# EAGLE schematic MegaWithL298 (EAGLE 7.3.0)
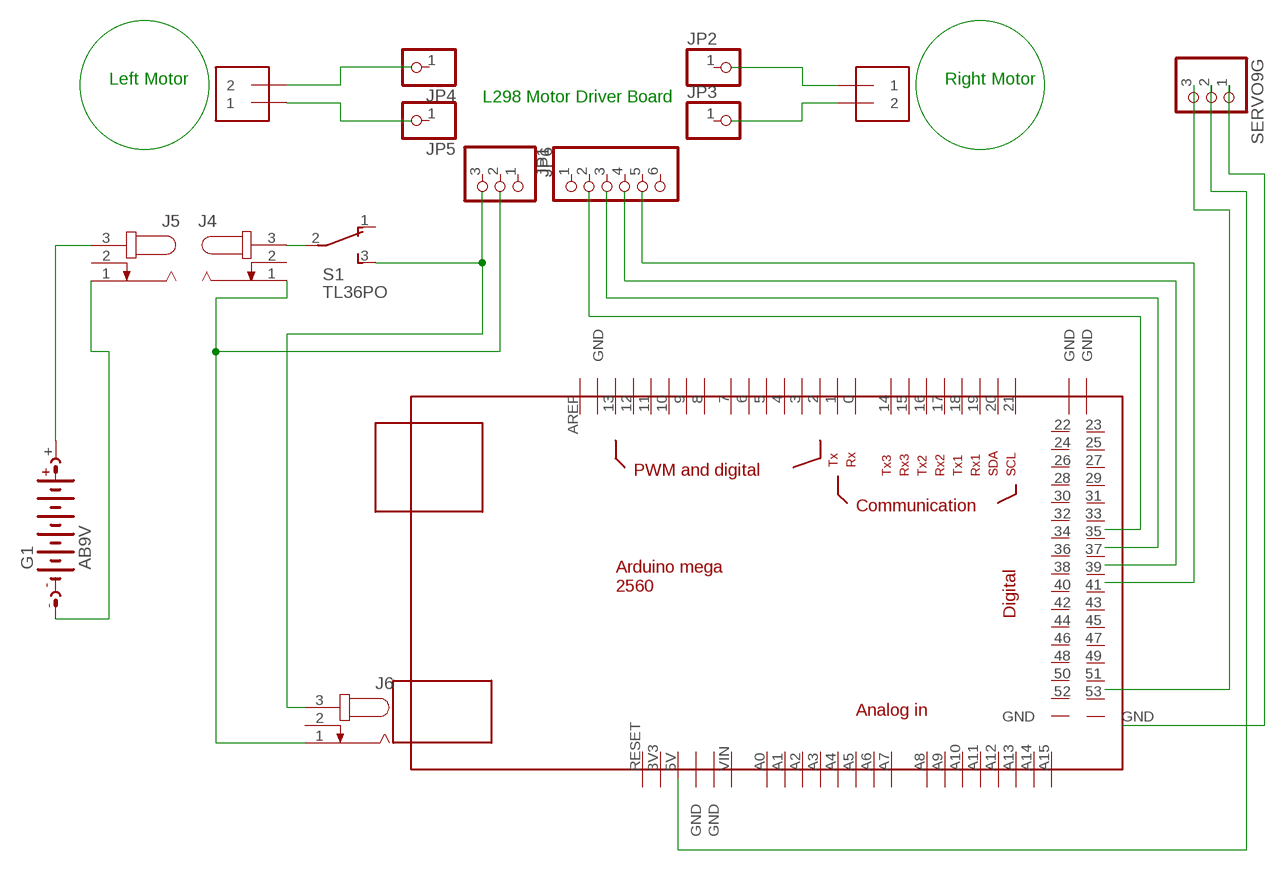
[diagram p0: schematic, sheet 1]

## Parts
G1  AB9V  [AB9V]
J2  1X2-3.5MM  [1X2-3.5MM]
J3  1X2-3.5MM  [1X2-3.5MM]
J4  RAPC7120  [RAPC712]
J5  RAPC7120  [RAPC712]
J6  RAPC7120  [RAPC712]
JP1  PINHD-1X6  [1X06]
JP2  PINHD-1X1  [1X01]
JP3  PINHD-1X1  [1X01]
JP4  PINHD-1X1  [1X01]
JP5  PINHD-1X1  [1X01]
JP6  PINHD-1X3  [1X03]
S1  TL36PO  [TL3XPO]
SERVO9G  PINHD-1X3  [1X03]
U$1  MEGA_DEVICE  [MEGABOX]

## Nets
N$1: J2.2
N$2: J2.1
N$3: J3.2
N$4: J3.1
N$10: SERVO9G.1
N$11: SERVO9G.2
N$12: J4.3 S1.2(P)
N$13: J6.3 S1.3(S)
N$14: G1.+ J5.3
N$15: G1.- J5.1
N$16: J4.1 J6.1
N$17: SERVO9G.3
Unconnected: J4.2 J5.2 J6.2 JP1.1 JP1.2 JP1.3 JP1.4 JP1.5 JP1.6 JP2.1 JP3.1 JP4.1 JP5.1 JP6.1 JP6.2 JP6.3 S1.1(O) U$1.0 U$1.1 U$1.2 U$1.3 U$1.3V3 U$1.4 U$1.5 U$1.5V U$1.6 U$1.7 U$1.8 U$1.9 U$1.10 U$1.11 U$1.12 U$1.13 U$1.14 U$1.15 U$1.16 U$1.17 U$1.18 U$1.19 U$1.20 U$1.21 U$1.22 U$1.23 U$1.24 U$1.25 U$1.26 U$1.27 U$1.28 U$1.29 U$1.30 U$1.31 U$1.32 U$1.33 U$1.34 U$1.35 U$1.36 U$1.37 U$1.38 U$1.39 U$1.40 U$1.41 U$1.42 U$1.43 U$1.44 U$1.45 U$1.46 U$1.47 U$1.48 U$1.49 U$1.50 U$1.51 U$1.52 U$1.53 U$1.A0 U$1.A1 U$1.A2 U$1.A3 U$1.A4 U$1.A5 U$1.A6 U$1.A7 U$1.A8 U$1.A9 U$1.A10 U$1.A11 U$1.A12 U$1.A13 U$1.A14 U$1.A15 U$1.AREF U$1.GND@1(GND) U$1.GND@2(GND) U$1.GND@3(GND) U$1.GND@4(GND) U$1.GND@5(GND) U$1.GND@6(GND) U$1.GND@7(GND) U$1.RESET U$1.VIN

## Notes on the sheet
- Left Motor | Right Motor
- L298 Motor Driver Board

## Library data of the parts
G1 = battery:AB9V: 9-V BATTERY CLIP
J2 J3 = adafruit:1X2: 3.5mm Terminal block http://www.ladyada.net/library/pcb/eaglelibrary.html
J4-J6 = RepRapjr:RAPC712: DC POWER JACK Power Jack, DC, Right Angle, Through Hole, Rated 5A at 16VDC, PC Terminals Distributor: Farnell (www.Farnell.de) Drawing: 84N1161.pdf / 84N1162.pdf Manufacturer: SPC Technology (www.spctechnology.com) Type: SPC4077 / SPC 4078
JP1 = adafruit:PINHD-1X6: PIN HEADER
JP2-JP5 = adafruit:PINHD-1X1: Pin header 1x1 for 0.1" spacing With round pins
JP6 SERVO9G = adafruit:PINHD-1X3: PIN HEADER
S1 = switch:TL36PO: TINY SWITCH ON - ON Source: http://www2.produktinfo.conrad.com/datenblaetter/700000-724999/705152-da-01-de-Subminiaturschalter_TL_36YO.pdf
U$1 = ArduinoMegaSymbol:MEGA_DEVICE: mega card as device